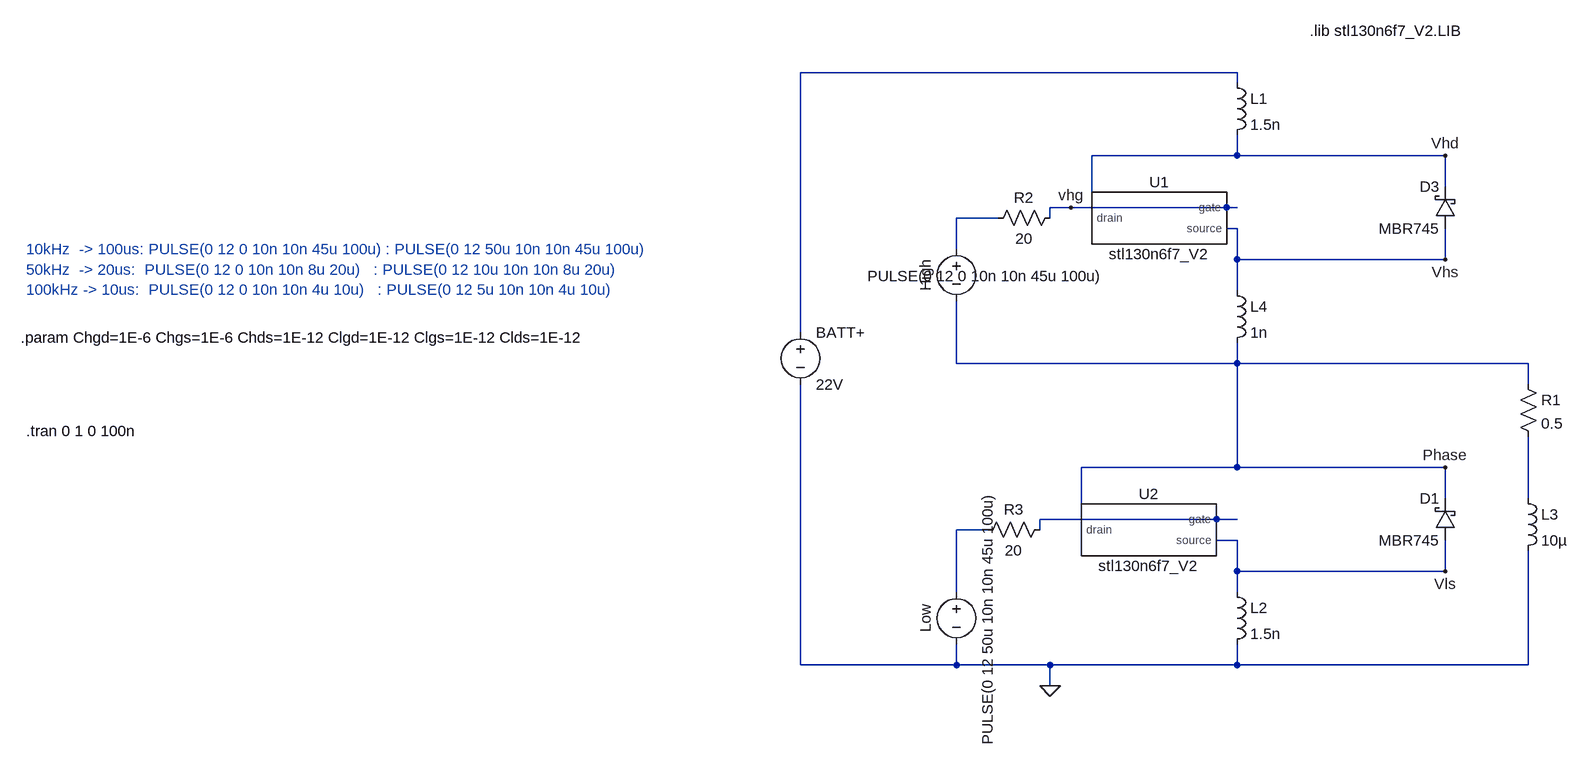
[diagram p0: schematic FETsims.asc]
FETsims.asc, the LTspice schematic file:
Version 4.1
SHEET 1 2488 748
WIRE 528 -304 -144 -304
WIRE 528 -288 528 -304
WIRE 528 -176 528 -208
WIRE 528 -176 304 -176
WIRE 848 -176 528 -176
WIRE 848 -128 848 -176
WIRE 272 -96 240 -96
WIRE 512 -96 272 -96
WIRE 528 -96 512 -96
WIRE 160 -80 96 -80
WIRE 240 -80 240 -96
WIRE 304 -80 304 -176
WIRE 528 -64 512 -64
WIRE 96 -32 96 -80
WIRE 528 -16 528 -64
WIRE 848 -16 848 -64
WIRE 848 -16 528 -16
WIRE 528 32 528 -16
WIRE -144 96 -144 -304
WIRE 96 144 96 48
WIRE 528 144 528 112
WIRE 528 144 96 144
WIRE 976 144 528 144
WIRE 976 176 976 144
WIRE 528 304 528 144
WIRE 528 304 288 304
WIRE 848 304 528 304
WIRE 848 352 848 304
WIRE 976 352 976 256
WIRE 496 384 224 384
WIRE 528 384 496 384
WIRE 144 400 96 400
WIRE 224 400 224 384
WIRE 288 400 288 304
WIRE 528 416 496 416
WIRE 528 464 528 416
WIRE 848 464 848 416
WIRE 848 464 528 464
WIRE 96 496 96 400
WIRE 528 496 528 464
WIRE -144 608 -144 176
WIRE 96 608 96 576
WIRE 96 608 -144 608
WIRE 240 608 96 608
WIRE 528 608 528 576
WIRE 528 608 240 608
WIRE 976 608 976 432
WIRE 976 608 528 608
WIRE 240 640 240 608
FLAG 240 640 0
FLAG 848 -176 Vhd
FLAG 848 -16 Vhs
FLAG 848 304 Phase
FLAG 848 464 Vls
FLAG 272 -96 vhg
SYMBOL voltage -144 80 R0
WINDOW 123 0 0 Left 0
WINDOW 39 0 0 Left 0
SYMATTR InstName BATT+
SYMATTR Value 22V
SYMBOL voltage 96 -48 R0
WINDOW 0 -32 56 VBottom 2
WINDOW 3 45 42 Top 2
WINDOW 123 0 0 Left 0
WINDOW 39 0 0 Left 0
SYMATTR InstName High
SYMATTR Value PULSE(0 12 0 10n 10n 45u 100u)
SYMBOL voltage 96 480 R0
WINDOW 0 -32 56 VBottom 2
WINDOW 3 32 56 VTop 2
WINDOW 123 0 0 Left 0
WINDOW 39 0 0 Left 0
SYMATTR InstName Low
SYMATTR Value PULSE(0 12 50u 10n 10n 45u 100u)
SYMBOL ind 512 -304 R0
SYMATTR InstName L1
SYMATTR Value 1.5n
SYMATTR SpiceLine Rpar=1u
SYMBOL ind 512 480 R0
SYMATTR InstName L2
SYMATTR Value 1.5n
SYMATTR SpiceLine Rser=1u
SYMBOL res 960 160 R0
SYMATTR InstName R1
SYMATTR Value 0.5
SYMBOL schottky 864 -64 R180
WINDOW 0 24 64 Left 2
WINDOW 3 24 0 Left 2
SYMATTR InstName D3
SYMATTR Value MBR745
SYMATTR Description Diode
SYMATTR Type diode
SYMBOL ind 512 16 R0
SYMATTR InstName L4
SYMATTR Value 1n
SYMATTR SpiceLine Rser=1u
SYMBOL schottky 864 416 R180
WINDOW 0 24 64 Left 2
WINDOW 3 24 0 Left 2
SYMATTR InstName D1
SYMATTR Value MBR745
SYMATTR Description Diode
SYMATTR Type diode
SYMBOL res 256 -96 R90
WINDOW 0 0 56 VBottom 2
WINDOW 3 32 56 VTop 2
SYMATTR InstName R2
SYMATTR Value 20
SYMBOL res 240 384 R90
WINDOW 0 0 56 VBottom 2
WINDOW 3 32 56 VTop 2
SYMATTR InstName R3
SYMATTR Value 20
SYMBOL ind 960 336 R0
SYMATTR InstName L3
SYMATTR Value 10µ
SYMBOL stl130n6f7_V2 400 -80 R0
SYMATTR InstName U1
SYMBOL stl130n6f7_V2 384 400 R0
SYMATTR InstName U2
TEXT -1344 104 Left 2 !.param Chgd=1E-6 Chgs=1E-6 Chds=1E-12 Clgd=1E-12 Clgs=1E-12 Clds=1E-12
TEXT -1336 -32 Left 2 ;10kHz  -> 100us: PULSE(0 12 0 10n 10n 45u 100u) : PULSE(0 12 50u 10n 10n 45u 100u)\n50kHz  -> 20us:  PULSE(0 12 0 10n 10n 8u 20u)   : PULSE(0 12 10u 10n 10n 8u 20u)\n100kHz -> 10us:  PULSE(0 12 0 10n 10n 4u 10u)   : PULSE(0 12 5u 10n 10n 4u 10u)
TEXT 640 -368 Left 2 !.lib stl130n6f7_V2.LIB
TEXT -1336 248 Left 2 !.tran 0 1 0 100n

The netlist it stands for:
* FETsims.asc
V§BATT+ N001 0 22V
V§High N002 Phase PULSE(0 12 0 10n 10n 45u 100u)
V§Low N005 0 PULSE(0 12 50u 10n 10n 45u 100u)
L1 N001 Vhd 1.5n Rpar=1u
L2 Vls 0 1.5n Rser=1u
R1 Phase N003 0.5
D3 Vhs Vhd MBR745
L4 Vhs Phase 1n Rser=1u
D1 Vls Phase MBR745
R2 vhg N002 20
R3 N004 N005 20
L3 N003 0 10µ
X§U1 Vhd vhg Vhs stl130n6f7_V2  ; pins drain gate source
X§U2 Phase N004 Vls stl130n6f7_V2  ; pins drain gate source
.model D D
.lib standard.dio
.param Chgd=1E-6 Chgs=1E-6 Chds=1E-12 Clgd=1E-12 Clgs=1E-12 Clds=1E-12
* 10kHz  -> 100us: PULSE(0 12 0 10n 10n 45u 100u) : PULSE(0 12 50u 10n 10n 45u 100u)
* 50kHz  -> 20us:  PULSE(0 12 0 10n 10n 8u 20u)   : PULSE(0 12 10u 10n 10n 8u 20u)
* 100kHz -> 10us:  PULSE(0 12 0 10n 10n 4u 10u)   : PULSE(0 12 5u 10n 10n 4u 10u)
.lib stl130n6f7_V2.LIB
.tran 0 1 0 100n
.lib C:\Users\nicho\OneDrive - UBC\GitHub\Rocket\thrust_vectoring_consolidated\electrical-hardware\ESC\stl130n6f7_V2.LIB
.backanno
.end